# Altium schematic sheet Air724UG_Air723UG.SchDoc
size 594 x 419 mm
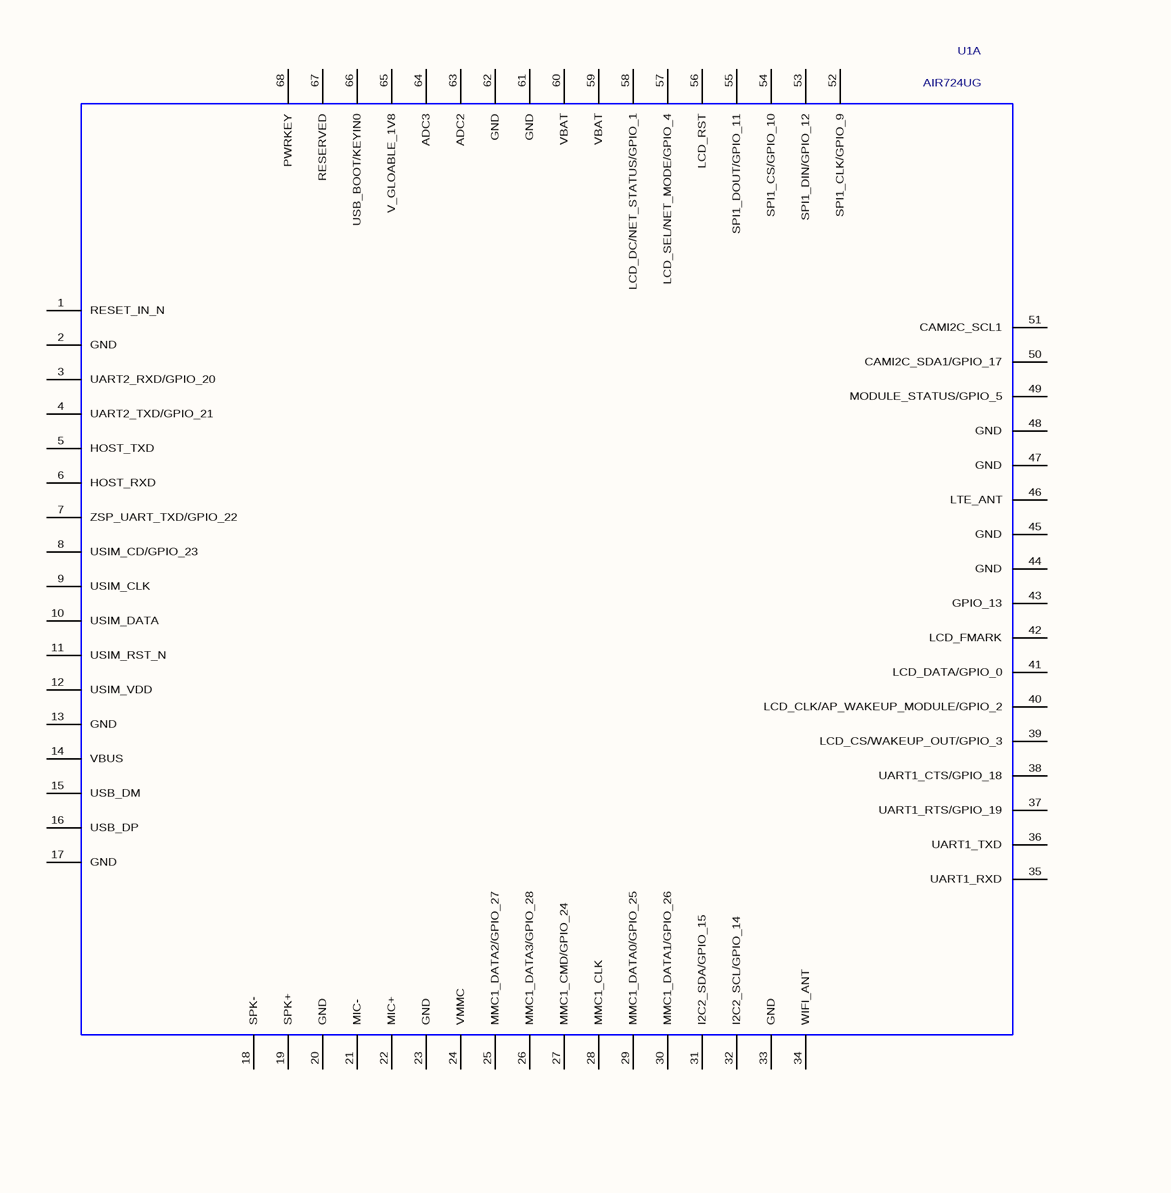
[diagram p0: Air724UG_Air723UG.SchDoc, top left]
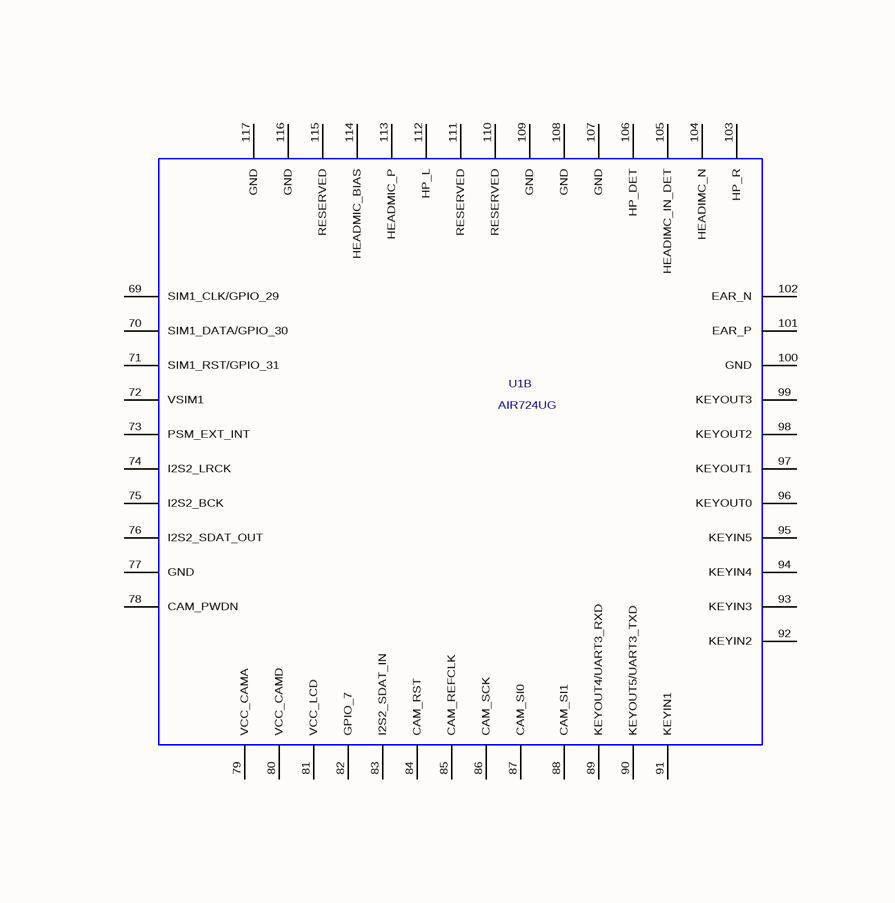
[diagram p1: Air724UG_Air723UG.SchDoc, top right]
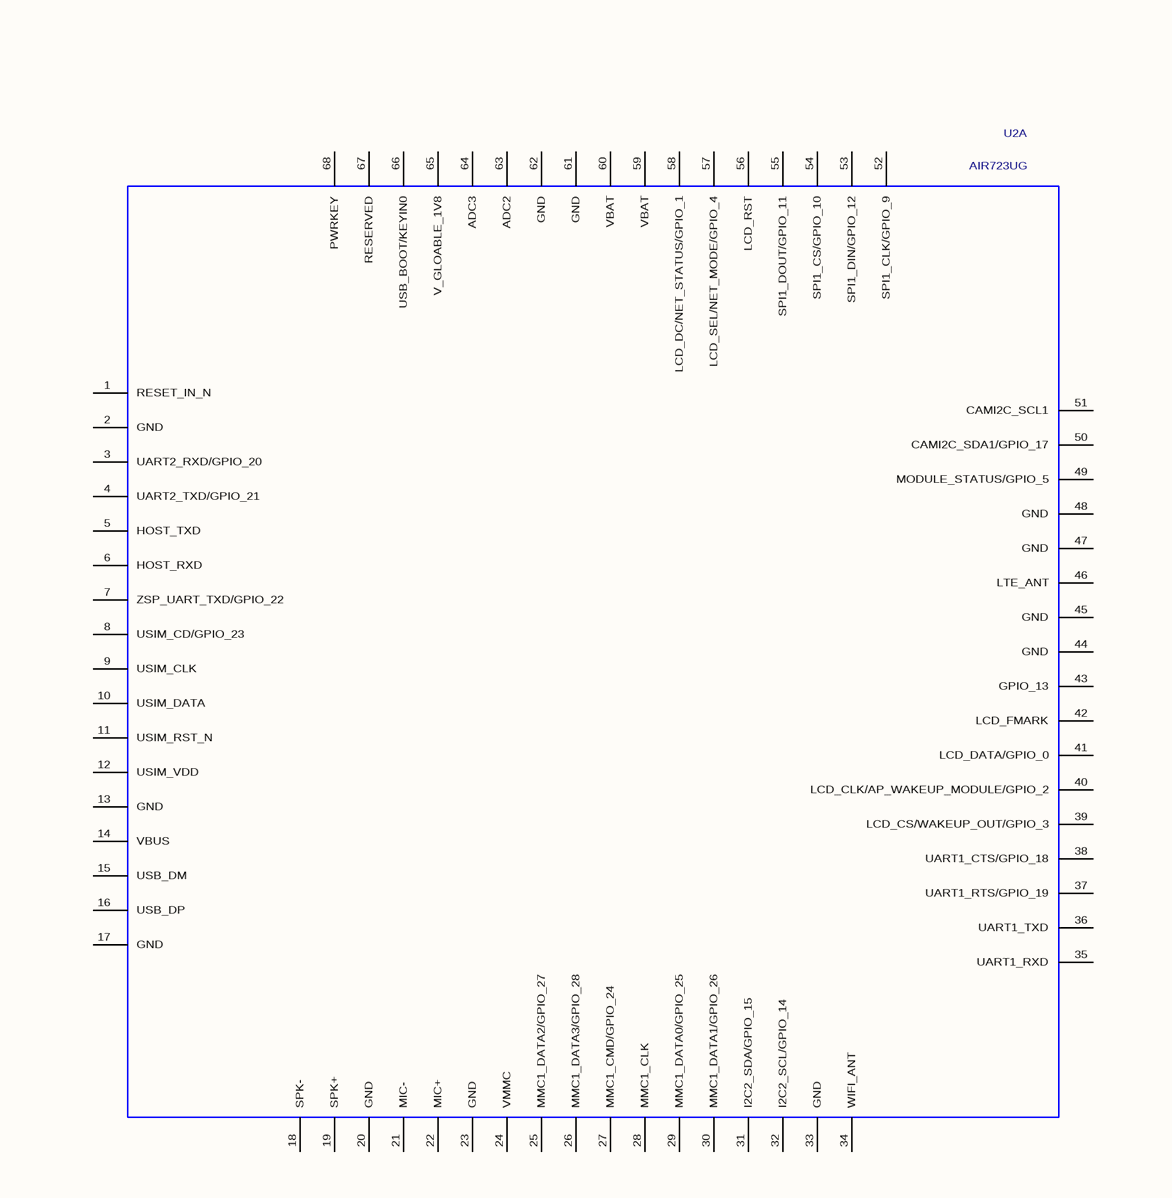
[diagram p2: Air724UG_Air723UG.SchDoc, bottom left]
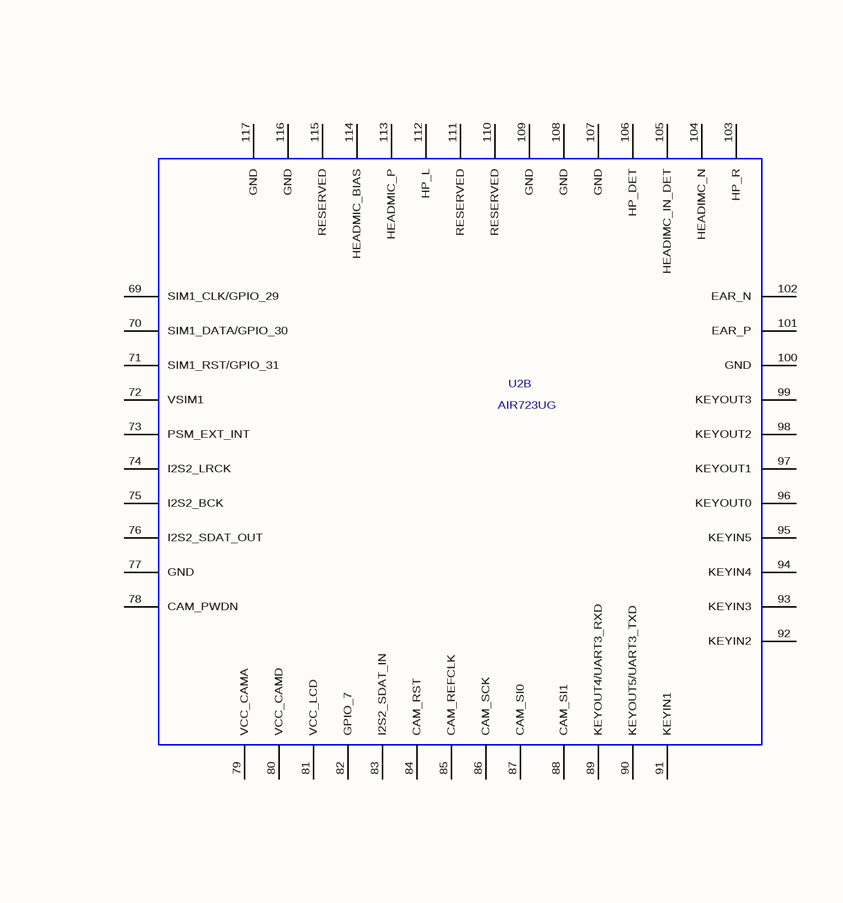
[diagram p3: Air724UG_Air723UG.SchDoc, bottom right]

## Parts
U1  AIR724UG  [AIR724UG]  (parts A,B of 2)
U2  AIR723UG  [AIR723UG]  (parts A,B of 2)

## Nets

Not connected (* = marked no-connect by the designer): U1 1(RESET_IN_N) 2(GND) 3(UART2_RXD/GPIO_20) 4(UART2_TXD/GPIO_21) 5(HOST_TXD) 6(HOST_RXD) 7(ZSP_UART_TXD/GPIO_22) 8(USIM_CD/GPIO_23) 9(USIM_CLK) 10(USIM_DATA) 11(USIM_RST_N) 12(USIM_VDD) 13(GND) 14(VBUS) 15(USB_DM) 16(USB_DP) 17(GND) 18(SPK-) 19(SPK+) 20(GND) 21(MIC-) 22(MIC+) 23(GND) 24(VMMC) 25(MMC1_DATA2/GPIO_27) 26(MMC1_DATA3/GPIO_28) 27(MMC1_CMD/GPIO_24) 28(MMC1_CLK) 29(MMC1_DATA0/GPIO_25) 30(MMC1_DATA1/GPIO_26) 31(I2C2_SDA/GPIO_15) 32(I2C2_SCL/GPIO_14) 33(GND) 34(WIFI_ANT) 35(UART1_RXD) 36(UART1_TXD) 37(UART1_RTS/GPIO_19) 38(UART1_CTS/GPIO_18) 39(LCD_CS/WAKEUP_OUT/GPIO_3) 40(LCD_CLK/AP_WAKEUP_MODULE/GPIO_2) 41(LCD_DATA/GPIO_0) 42(LCD_FMARK) 43(GPIO_13) 44(GND) 45(GND) 46(LTE_ANT) 47(GND) 48(GND) 49(MODULE_STATUS/GPIO_5) 50(CAMI2C_SDA1/GPIO_17) 51(CAMI2C_SCL1) 52(SPI1_CLK/GPIO_9) 53(SPI1_DIN/GPIO_12) 54(SPI1_CS/GPIO_10) 55(SPI1_DOUT/GPIO_11) 56(LCD_RST) 57(LCD_SEL/NET_MODE/GPIO_4) 58(LCD_DC/NET_STATUS/GPIO_1) 59(VBAT) 60(VBAT) 61(GND) 62(GND) 63(ADC2) 64(ADC3) 65(V_GLOABLE_1V8) 66(USB_BOOT/KEYIN0) 67(RESERVED) 68(PWRKEY) 69(SIM1_CLK/GPIO_29) 70(SIM1_DATA/GPIO_30) 71(SIM1_RST/GPIO_31) 72(VSIM1) 73(PSM_EXT_INT) 74(I2S2_LRCK) 75(I2S2_BCK) 76(I2S2_SDAT_OUT) 77(GND) 78(CAM_PWDN) 79(VCC_CAMA) 80(VCC_CAMD) 81(VCC_LCD) 82(GPIO_7) 83(I2S2_SDAT_IN) 84(CAM_RST) 85(CAM_REFCLK) 86(CAM_SCK) 87(CAM_SI0) 88(CAM_SI1) 89(KEYOUT4/UART3_RXD) 90(KEYOUT5/UART3_TXD) 91(KEYIN1) 92(KEYIN2) 93(KEYIN3) 94(KEYIN4) 95(KEYIN5) 96(KEYOUT0) 97(KEYOUT1) 98(KEYOUT2) 99(KEYOUT3) 100(GND) 101(EAR_P) 102(EAR_N) 103(HP_R) 104(HEADIMC_N) 105(HEADIMC_IN_DET) 106(HP_DET) 107(GND) 108(GND) 109(GND) 110(RESERVED) 111(RESERVED) 112(HP_L) 113(HEADMIC_P) 114(HEADMIC_BIAS) 115(RESERVED) 116(GND) 117(GND); U2 1(RESET_IN_N) 2(GND) 3(UART2_RXD/GPIO_20) 4(UART2_TXD/GPIO_21) 5(HOST_TXD) 6(HOST_RXD) 7(ZSP_UART_TXD/GPIO_22) 8(USIM_CD/GPIO_23) 9(USIM_CLK) 10(USIM_DATA) 11(USIM_RST_N) 12(USIM_VDD) 13(GND) 14(VBUS) 15(USB_DM) 16(USB_DP) 17(GND) 18(SPK-) 19(SPK+) 20(GND) 21(MIC-) 22(MIC+) 23(GND) 24(VMMC) 25(MMC1_DATA2/GPIO_27) 26(MMC1_DATA3/GPIO_28) 27(MMC1_CMD/GPIO_24) 28(MMC1_CLK) 29(MMC1_DATA0/GPIO_25) 30(MMC1_DATA1/GPIO_26) 31(I2C2_SDA/GPIO_15) 32(I2C2_SCL/GPIO_14) 33(GND) 34(WIFI_ANT) 35(UART1_RXD) 36(UART1_TXD) 37(UART1_RTS/GPIO_19) 38(UART1_CTS/GPIO_18) 39(LCD_CS/WAKEUP_OUT/GPIO_3) 40(LCD_CLK/AP_WAKEUP_MODULE/GPIO_2) 41(LCD_DATA/GPIO_0) 42(LCD_FMARK) 43(GPIO_13) 44(GND) 45(GND) 46(LTE_ANT) 47(GND) 48(GND) 49(MODULE_STATUS/GPIO_5) 50(CAMI2C_SDA1/GPIO_17) 51(CAMI2C_SCL1) 52(SPI1_CLK/GPIO_9) 53(SPI1_DIN/GPIO_12) 54(SPI1_CS/GPIO_10) 55(SPI1_DOUT/GPIO_11) 56(LCD_RST) 57(LCD_SEL/NET_MODE/GPIO_4) 58(LCD_DC/NET_STATUS/GPIO_1) 59(VBAT) 60(VBAT) 61(GND) 62(GND) 63(ADC2) 64(ADC3) 65(V_GLOABLE_1V8) 66(USB_BOOT/KEYIN0) 67(RESERVED) 68(PWRKEY) 69(SIM1_CLK/GPIO_29) 70(SIM1_DATA/GPIO_30) 71(SIM1_RST/GPIO_31) 72(VSIM1) 73(PSM_EXT_INT) 74(I2S2_LRCK) 75(I2S2_BCK) 76(I2S2_SDAT_OUT) 77(GND) 78(CAM_PWDN) 79(VCC_CAMA) 80(VCC_CAMD) 81(VCC_LCD) 82(GPIO_7) 83(I2S2_SDAT_IN) 84(CAM_RST) 85(CAM_REFCLK) 86(CAM_SCK) 87(CAM_SI0) 88(CAM_SI1) 89(KEYOUT4/UART3_RXD) 90(KEYOUT5/UART3_TXD) 91(KEYIN1) 92(KEYIN2) 93(KEYIN3) 94(KEYIN4) 95(KEYIN5) 96(KEYOUT0) 97(KEYOUT1) 98(KEYOUT2) 99(KEYOUT3) 100(GND) 101(EAR_P) 102(EAR_N) 103(HP_R) 104(HEADIMC_N) 105(HEADIMC_IN_DET) 106(HP_DET) 107(GND) 108(GND) 109(GND) 110(RESERVED) 111(RESERVED) 112(HP_L) 113(HEADMIC_P) 114(HEADMIC_BIAS) 115(RESERVED) 116(GND) 117(GND)

## Library data of the parts
U1 = AIR724UG: Manufacture 1: AirM2M; Geometry.Height: 2.3mm; Manufacture 1 P/N: Air724UG; Description: Air724UG; PCB DECAL: AIR724UG
U2 = AIR723UG: Air723UG;23.0*23.0*2.3mm; Manufacture 1: AirM2M; Geometry.Height: 2.3mm; Manufacture 1 P/N: Air723UG; PCB DECAL: AIR723UG